# EAGLE design c12880ma-spectrometer-3.3v-breakout-mk-1.1.0 (EAGLE 9.4.2)
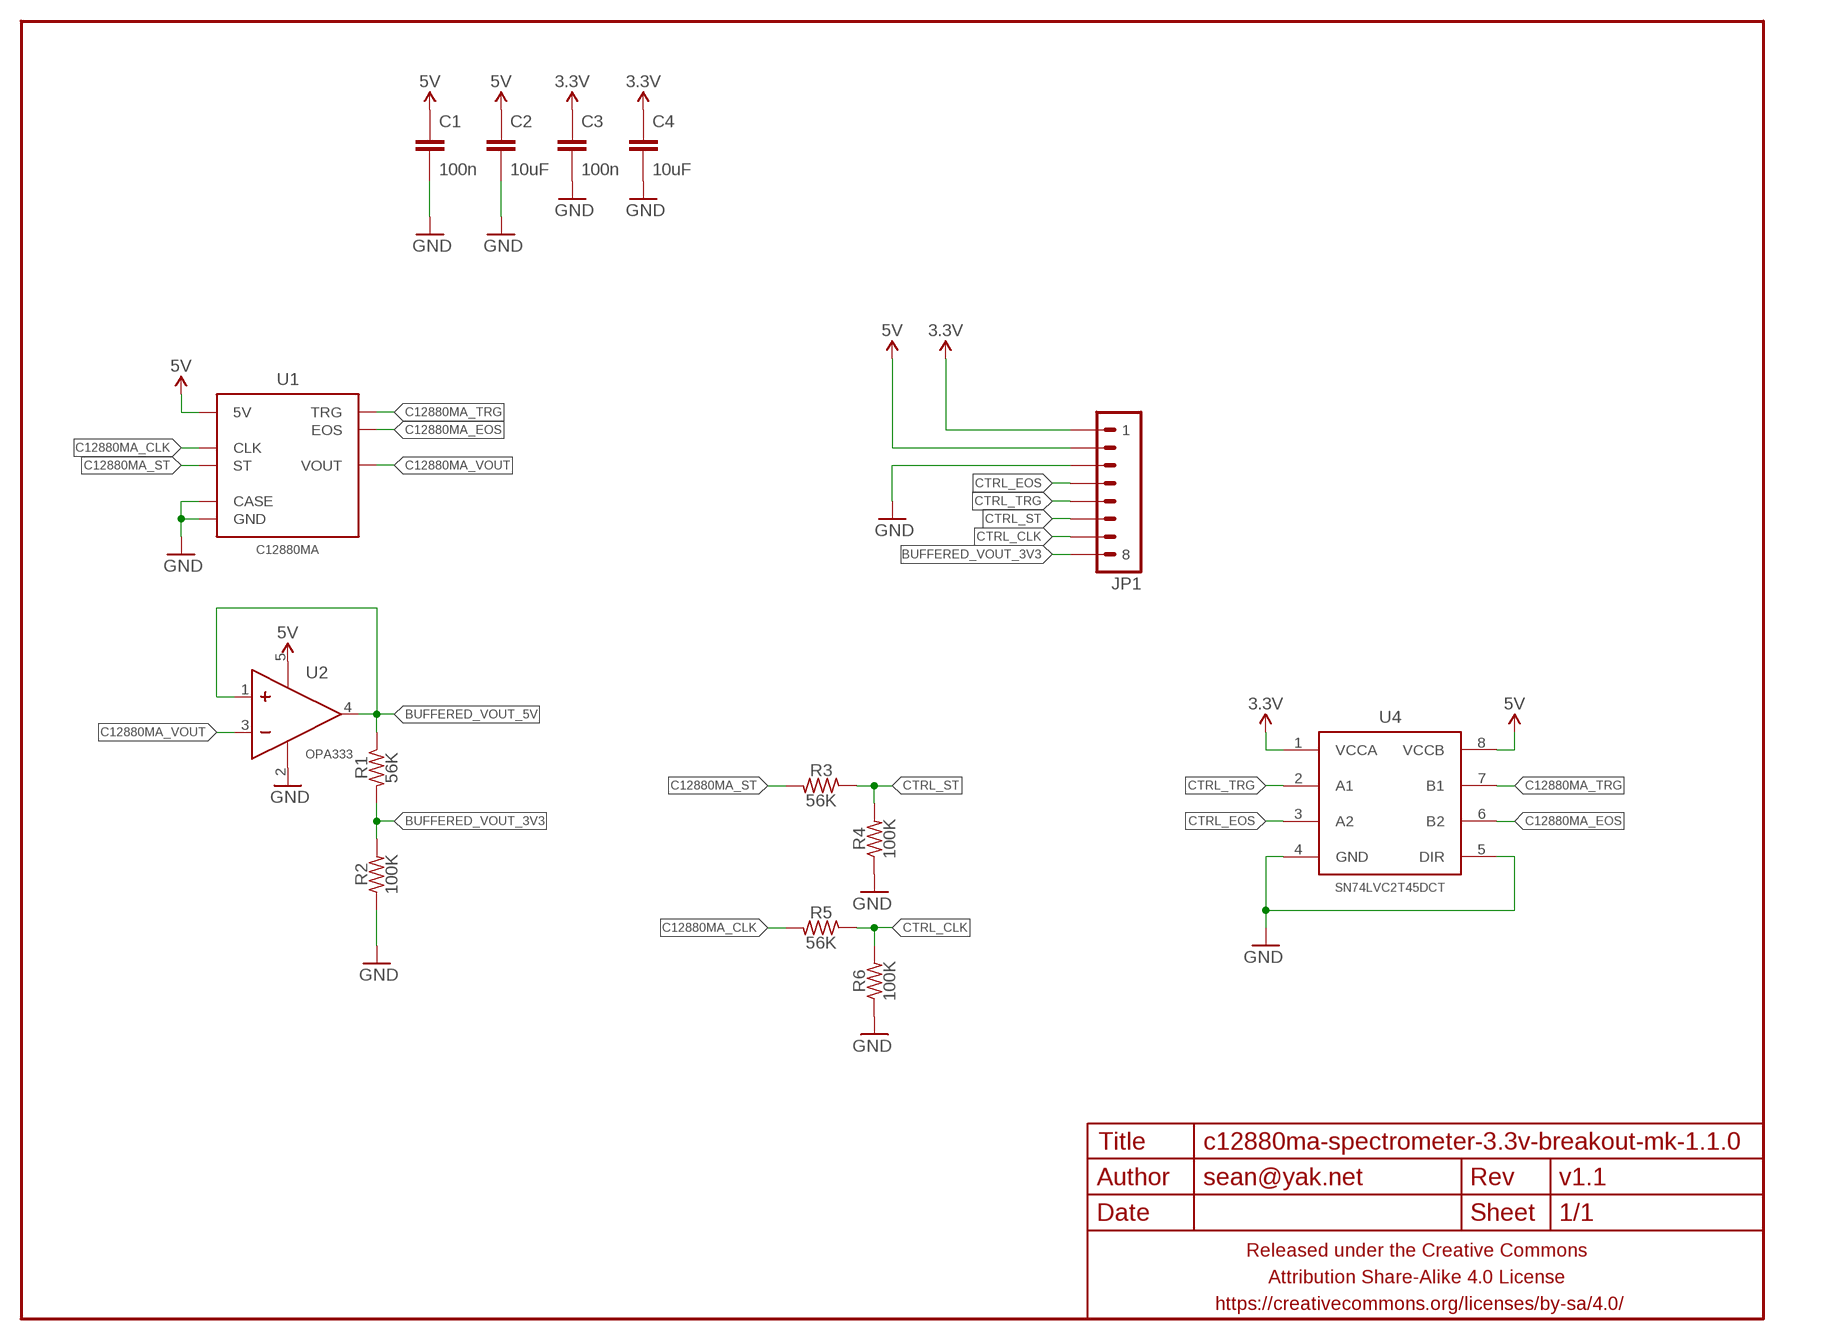
[diagram p0: schematic, sheet 1]

## Parts
C1  100n  CAPACITOR-CERAMICC0402  [C0402]
C2  10uF  CAPACITOR-CERAMICC0603-TIGHTER  [C0603-TIGHTER]
C3  100n  CAPACITOR-CERAMICC0402  [C0402]
C4  10uF  CAPACITOR-CERAMICC0603-TIGHTER  [C0603-TIGHTER]
FRAME1  FRAME-LETTERNO_PACKAGE  [DUMMY]
JP1  M081X08  [1X08]
R1  56K  RESISTORR0402  [R0402]
R2  100K  RESISTORR0402  [R0402]
R3  56K  RESISTORR0402  [R0402]
R4  100K  RESISTORR0402  [R0402]
R5  56K  RESISTORR0402  [R0402]
R6  100K  RESISTORR0402  [R0402]
U1  C12880MA  [DIL14]
U2  OPA333  OPAMPOPA333-SC-70  [SC70]
U4  SN74LVC2T45DCT  [SSOP-8]

## Nets
3.3V: C3.1 C4.1 JP1.1 U4.1(VCCA)
5V: C1.1 C2.1 JP1.2 U1.1(5V) U1.5(5V) U2.5(V+) U4.8(VCCB)
BUFFERED_VOUT_3V3: JP1.8 R1.2 R2.2
BUFFERED_VOUT_5V: R1.1 U2.1(IN+) U2.4(OUT)
C12880MA_CLK: R5.2 U1.6(CLK)
C12880MA_EOS: U1.13(EOS) U4.6(B2)
C12880MA_ST: R3.2 U1.8(ST)
C12880MA_TRG: U1.9(TRG) U4.7(B1)
C12880MA_VOUT: U1.14(VOUT) U2.3(IN-)
CTRL_CLK: JP1.7 R5.1 R6.2
CTRL_EOS: JP1.4 U4.3(A2)
CTRL_ST: JP1.6 R3.1 R4.2
CTRL_TRG: JP1.5 U4.2(A1)
GND: C1.2 C2.2 C3.2 C4.2 JP1.3 R2.1 R4.1 R6.1 U1.2(GND) U1.7(CASE) U2.2(V-) U4.4(GND) U4.5(DIR)

## Library data of the parts
C1-C4 = a_parts:CAPACITOR-CERAMIC: CAPACITOR, European symbol
FRAME1 = a_parts:FRAME-LETTER: Schematic Frame Standard 8.5x11 US Letter frame; DESIGNER: sean@yak.net; VERSION: v1.1
JP1 = a_parts:M08: Header 8 Standard 8-pin 0.1" header. Use with straight break away headers (SKU : PRT-00116), right angle break away headers (PRT-00553), swiss pins (PRT-00743), machine pins (PRT-00117), and female headers (PRT-00115).
R1-R6 = a_parts:RESISTOR: RESISTOR, American symbol
U1 = a_parts:C12880MA
U2 = a_parts:OPAMP
U4 = a_parts:SN74LVC2T45

## Board
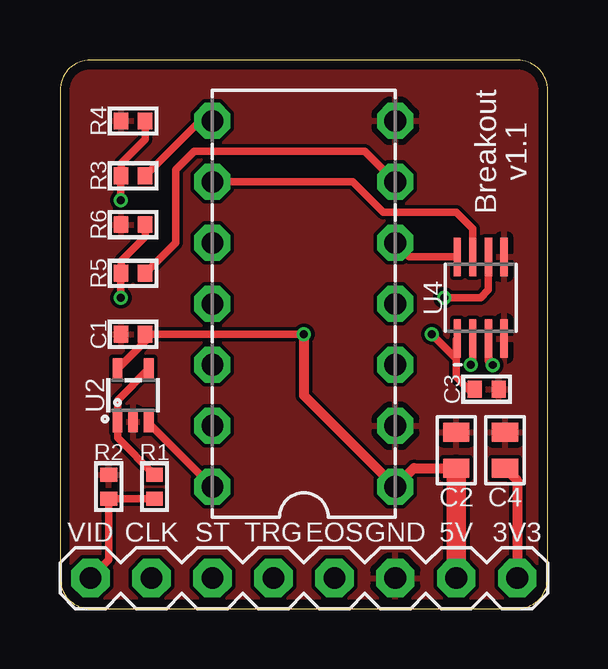
[diagram p1: board, top side]
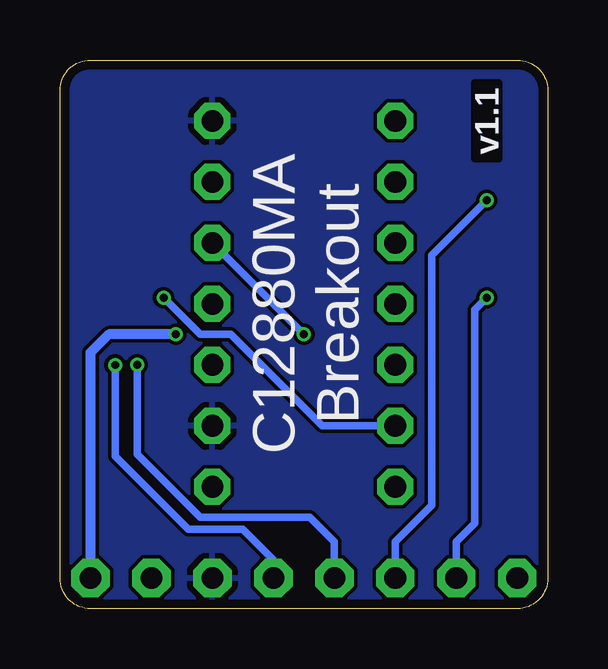
[diagram p2: board, bottom side, seen from below]

Size 20.32 x 22.86 mm. Coordinates in mm from the lower left corner, seen from the top.
Outline: 20.32,1.27 20.32,21.59 arc90 19.05,22.86 1.27,22.86 arc90 0,21.59 0,1.27 arc90 1.27,0 19.05,0 arc90 20.32,1.27
Copper layers (1*16): Top 0.035559375mm / dielectric 1.6mm / Bottom 0.035559375mm
Design rules "oshpark-2layer": minimum track width 6mil, minimum drill 10mil, track to track 6mil, track to pad 6mil, pad to pad 6mil, via to via 6mil, smd to smd 0mil, copper to edge 15mil, drill to drill 6mil, minimum pad ring 5mil, minimum via ring 5mil, stop-mask expansion 2.5mil, vias tented up to drill 20mil, thermal gap 10mil

### Footprints (pad centres in the part's own frame; a part is rotated, then mirrored left to right if it is on the bottom)
C0402 = smd 0.6 x 0.7: 1 -0.5,0; 2 0.5,0
C0603-TIGHTER = smd 0.8 x 1.1: 1 -0.75,0; 2 0.75,0
1X08 = drill 0.9 pad 1.6 octagon: 1 0,0; 2 2.54,0; 3 5.08,0; 4 7.62,0; 5 10.16,0; 6 12.7,0; 7 15.24,0; 8 17.78,0
R0402 = smd 0.6 x 0.7: 1 -0.5,0; 2 0.5,0
DIL14 = drill 0.9 pad 1.5 octagon: 1 -7.62,-3.81; 2 -5.08,-3.81; 3 -2.54,-3.81; 4 0,-3.81; 5 2.54,-3.81; 6 5.08,-3.81; 7 7.62,-3.81; 8 7.62,3.81; 9 5.08,3.81; 10 2.54,3.81; 11 0,3.81; 12 -2.54,3.81; 13 -5.08,3.81; 14 -7.62,3.81
SC70 = smd 0.4 x 0.9: 1 -0.65,-1.1; 2 0,-1.1; 3 0.65,-1.1; 4 0.65,1.1; 5 -0.65,1.1
SSOP-8 = smd 1.6 x 0.3: 1 -1.7,0.975; 2 -1.7,0.325; 3 -1.7,-0.325; 4 -1.7,-0.975; 5 1.7,-0.975; 6 1.7,-0.325; 7 1.7,0.325; 8 1.7,0.975

### Placement (x,y rotation side)
C1  3.05,11.43 180 top
C2  16.51,6.6 90 top
C3  17.78,9.14 0 top
C4  18.54,6.6 90 top
FRAME1  0,0 0 top
JP1  19.05,1.27 180 top
R1  3.94,5.08 270 top
R2  2.03,5.08 270 top
R3  3.05,18.03 0 top
R4  3.05,20.32 0 top
R5  3.05,13.97 0 top
R6  3.05,16 0 top
U1  10.16,12.7 90 top
U2  3.05,8.89 0 top
U4  17.53,12.95 90 top

### Tracks (layer width: path | path; a pad name or v marks a point on that pad's centre or on a via)
3.3V  (via drill 0.33)
  Top 0.305: v15.49,11.43 16.51,10.41 | 16.51,10.41 16.51,9.65 17.02,9.14 C3.1 | U4.1 16.51,11.21 16.51,10.41
  Top 0.406: C4.1 19.05,5.35 JP1.1
  Bottom 0.406: v15.49,11.43 18.29,11.43 19.05,10.67 JP1.1
5V  (via drill 0.33)
  Top 0.305: U2.5 3.55,11.14 C1.1 v10.16,11.43 | U4.8 14.56,14.65 U1.5
  Top 0.406: v10.16,11.43 10.16,8.89 U1.1 14.74,5.85 C2.1
  Top 0.813: C2.1 JP1.2
  Bottom 0.305: v10.16,11.43 U1.5
BUFFERED_VOUT_3V3
  Top 0.305: R1.2 R2.2 2.03,2.03 JP1.8
BUFFERED_VOUT_5V
  Top 0.305: U2.4 2.4,8.69 U2.1 2.4,7.12 R1.1
C12880MA_CLK
  Top 0.305: R5.2 4.83,15.25 4.83,18.29 5.59,19.05 12.7,19.05 U1.6
C12880MA_EOS  (via drill 0.33)
  Top 0.305: U4.6 17.85,13.28 17.53,12.95 v16,12.95
  Bottom 0.305: v16,12.95 14.48,11.43 13.21,11.43 9.4,7.62 U1.13
C12880MA_ST
  Top 0.305: R3.2 5.83,20.32 U1.8
C12880MA_TRG
  Top 0.305: U1.9 12.19,17.78 13.46,16.51 16.51,16.51 17.2,15.82 U4.7
C12880MA_VOUT
  Top 0.305: U2.3 3.7,7.73 U1.14
CTRL_CLK  (via drill 0.33)
  Top 0.305: R6.2 3.55,15.49 2.55,14.49 R5.1 v2.54,12.95
  Bottom 0.305: v2.54,12.95 3.05,12.45 3.05,3.56 3.81,2.79 JP1.7
CTRL_EOS  (via drill 0.33)
  Top 0.305: U4.3 17.85,10.32 v18.02,10.15
  Bottom 0.305: v18.02,10.15 18.02,6.34 14.99,3.3 12.7,3.3 11.43,2.03 JP1.4
CTRL_ST  (via drill 0.33)
  Top 0.305: R4.2 3.55,19.55 2.55,18.55 R3.1 v2.54,17.02
  Bottom 0.305: v2.54,17.02 4.83,14.73 4.83,4.32 6.35,2.79 JP1.6
CTRL_TRG  (via drill 0.33)
  Top 0.305: U4.2 17.2,10.25 v17.11,10.16
  Bottom 0.305: v17.11,10.16 17.11,6.44 14.48,3.81 9.91,3.81 8.89,2.79 JP1.5
GND
  pour Bottom: 0,22.86 0,0 20.32,0 20.32,22.86
  pour Top: 0,22.86 0,0 20.32,0 20.32,22.86

### Text on the board
tPlace: Breakout | VID | CLK | ST | TRG | EOS | GND | 5V | 3V3
bPlace: C12880MA / Breakout